# Altium schematic sheet ENC28J60EthernetInterface.SchDoc
size A; SheetNumber: 12; SheetTotal: 14
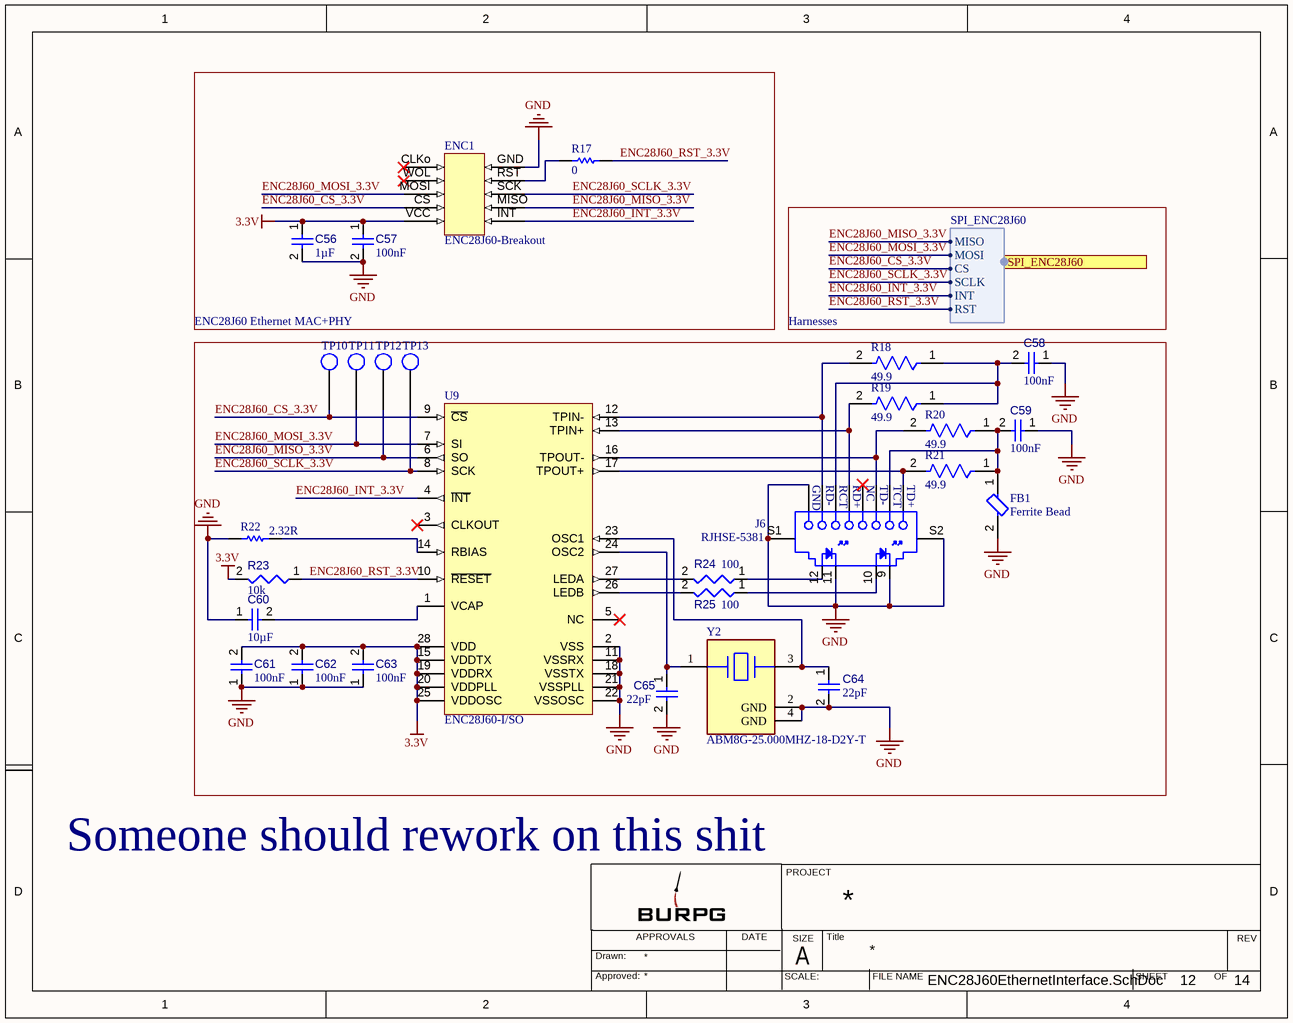
[diagram p0: ENC28J60EthernetInterface.SchDoc]

## Parts
C56  value 1µF  [CAPC2013X135X45NL10T25]  (hidden comment: Capacitor 1 uF +/- 10% 50 V 0805)
C57  value 100nF  [CAPC2013X95X50LL10T25]  (hidden comment: Capacitor 100 nF +/-10% 50 V 0805)
C58  value 100nF  [CAPC1608X90X40NL10T20]  (hidden comment: Capacitor 100 nF +/-10% 50 V 0603)
C59  value 100nF  [CAPC1608X90X40NL10T20]  (hidden comment: Capacitor 100 nF +/-10% 50 V 0603)
C60  value 10µF  [CAPC0603(1608)100_L]  (hidden comment: Capacitor 10µF +/-20% 10V 0603)
C61  value 100nF  [CAPC1608X90X40NL10T20]  (hidden comment: Capacitor 100 nF +/-10% 50 V 0603)
C62  value 100nF  [CAPC1608X90X40NL10T20]  (hidden comment: Capacitor 100 nF +/-10% 50 V 0603)
C63  value 100nF  [CAPC1608X90X40NL10T20]  (hidden comment: Capacitor 100 nF +/-10% 50 V 0603)
C64  value 22pF  [CAPC0402(1005)60_L]  (hidden comment: Capacitor 22pF +/-10% 50V 0402)
C65  value 22pF  [CAPC0402(1005)60_L]  (hidden comment: Capacitor 22pF +/-10% 50V 0402)
ENC1  ENC28J60-Breakout  [New footprint 1]
FB1  Ferrite Bead  [FP-MMZ1608-0_8-IPC_A]
J6  RJHSE-5381  [AMPH-RJHSE-5381_V]
R17  value 0  [RESC3216X60X45ML15T20]  (hidden comment: Resistor 0R +/- 5% 1206 250 mW)
R18  49.9  [FP-ERJ6EN-MFG]
R19  49.9  [FP-ERJ6EN-MFG]
R20  49.9  [FP-ERJ6EN-MFG]
R21  49.9  [FP-ERJ6EN-MFG]
R22  2.32R  [RESC2013X70X40NL20T20]
R23  value 10k  [RESC1005X40X25ML05T05]  (hidden comment: RES-2)
R24  value 100  [RESC0402(1005)_L]  (hidden comment: 100R2F)
R25  value 100  [RESC0402(1005)_L]  (hidden comment: 100R2F)
TP10  BURPG_TestPoint1  [BURPG_TestPoint1]  (value not drawn)  (no BOM)
TP11  BURPG_TestPoint1  [BURPG_TestPoint1]  (value not drawn)  (no BOM)
TP12  BURPG_TestPoint1  [BURPG_TestPoint1]  (value not drawn)  (no BOM)
TP13  BURPG_TestPoint1  [BURPG_TestPoint1]  (value not drawn)  (no BOM)
U9  ENC28J60-I/SO  [SOIC-SO28_M]
Y2  ABM8G-25.000MHZ-18-D2Y-T  [FP-ABM8G-MFG]

## Blocks framed on the sheet
ENC28J60 Ethernet MAC+PHY: C56 C57 ENC1 R17
Harnesses: C58-C65 FB1 J6 R18-R25 TP10-TP13 U9 Y2

## Ports
SPI_ENC28J60 (harness SPI_ENC28J60)

## Harnesses
SPI_ENC28J60: MISO, MOSI, CS, SCLK, INT, RST

## Nets
3.3V: C56.1 C57.1 C61.2 C62.2 C63.2 ENC1.VCC R23.2 U9.15(VDDTX) U9.19(VDDRX) U9.20(VDDPLL) U9.25(VDDOSC) U9.28(VDD)
GND: C56.2 C57.2 C58.1 C59.1 C60.1 C61.1 C62.1 C63.1 C64.2 C65.2 ENC1.GND FB1.2 J6.8(GND) J6.9 J6.11 J6.S1 J6.S2 R22.1 U9.2(VSS) U9.11(VSSRX) U9.18(VSSTX) U9.21(VSSPLL) U9.22(VSSOSC) Y2.2(GND) Y2.4(GND)
ENC28J60_CS_3.3V: ENC1.CS TP10.1 U9.9(~{CS}) ; port SPI_ENC28J60.CS
ENC28J60_INT_3.3V: ENC1.INT U9.4(~{INT}) ; port SPI_ENC28J60.INT
ENC28J60_MISO_3.3V: ENC1.MISO TP12.1 U9.6(SO) ; port SPI_ENC28J60.MISO
ENC28J60_MOSI_3.3V: ENC1.MOSI TP11.1 U9.7(SI) ; port SPI_ENC28J60.MOSI
ENC28J60_RST_3.3V: R17.2 R23.1 U9.10(~{RESET}) ; port SPI_ENC28J60.RST
ENC28J60_SCLK_3.3V: ENC1.SCK TP13.1 U9.8(SCK) ; port SPI_ENC28J60.SCLK
NetC58_2: C58.2 J6.6(RCT) R18.1 R19.1
NetC59_2: C59.2 FB1.1 J6.2(TCT) R20.1 R21.1
NetC60_2: C60.2 U9.1(VCAP)
NetC64_1: C64.1 U9.23(OSC1) Y2.3
NetC65_1: C65.1 U9.24(OSC2) Y2.1
NetENC1_RST: ENC1.RST R17.1
NetJ6_1: J6.1(TD+) R21.2 U9.17(TPOUT+)
NetJ6_3: J6.3(TD-) R20.2 U9.16(TPOUT-)
NetJ6_5: J6.5(RD+) R19.2 U9.13(TPIN+)
NetJ6_7: J6.7(RD-) R18.2 U9.12(TPIN-)
NetJ6_10: J6.10 R25.1
NetJ6_12: J6.12 R24.1
NetR22_2: R22.2 U9.14(RBIAS)
NetR24_2: R24.2 U9.27(LEDA)
NetR25_2: R25.2 U9.26(LEDB)

Not connected (* = marked no-connect by the designer): ENC1 CLKo* WOL*; J6 4(NC)*; U9 3(CLKOUT)* 5(NC)*

## Notes on the sheet
- Someone should rework on this shit
- PROJECT
- Drawn:
- Approved:
- APPROVALS
- DATE
- SCALE:
- SIZE
- A
- Title
- FILE NAME
- SHEET
- OF
- REV

## Library data of the parts
C56 = CMP-001-00007-6: Chip Capacitor, 1 uF, +/- 10%, 50 V, 0805 (2012 Metric); Capacitor Type: Ceramic; Voltage Rating: 50V; Case/Package: 0805; Max Operating Temperature: 125°C; Min Operating Temperature: -55°C; Mounting Technology: SM; Pins: 2; RoHS Compliant: True; Tolerance: 10%
C57 = CMP-001-00018-6: Chip Capacitor, 100 nF, +/- 10%, 50 V, 0805 (2012 Metric); Capacitor Type: Ceramic; Voltage Rating: 50V; Case/Package: 0805; Max Operating Temperature: 125°C; Min Operating Temperature: -55°C; Mounting Technology: SM; Pins: 2; RoHS Compliant: True; Tolerance: 10%
C58 C59 C61-C63 = CMP-001-00017-6: Chip Capacitor, 100 nF, +/- 10%, 50 V, 0603 (1608 Metric); Voltage Rating: 50V; Capacitor Type: Ceramic; Tolerance: 10%; Mounting Technology: SM; Max Operating Temperature: 125°C; RoHS Compliant: True; Pins: 2; Case/Package: 0603; Min Operating Temperature: -55°C
C60 = CMP-001-00075-4: Chip Capacitor, 10µF +/-20%, 10V, 0603, Thickness 1 mm; Tolerance: 10%; Voltage Rating: 10V; Max Operating Temperature: 85°C; Pins: 2; Case/Package: 0603; Mounting Technology: SMT; Min Operating Temperature: -55°C
C64 C65 = CMP-001-00073-3: Chip Capacitor, 22pF +/-10%, 50V, 0402, Thickness 0.6 mm; Tolerance: 10%; Pins: 2; Voltage Rating: 50V; Max Operating Temperature: 85°C; Min Operating Temperature: -55°C; Mounting Technology: SMT; Case/Package: 0402
ENC1 = CMP-031-00007-1
FB1 = CMP-08257-000284-1: Signal Line Ferrite Bead 60Ω  @ 100MHz 500mA DCR 150mΩ SMD 0603; DC Resistance (DCR): 150mR; Impedance: 60R; Tolerance: 25%; Case/Package: 0603; RoHS Compliant: Yes; Package Quantity: 4000; Lead Free: Lead Free; Case Code (Imperial): 0603; Height: 0.037inch; REACH SVHC: No SVHC; Case Code (Metric): 1608; Packaging: Cut Tape; Mount: Surface Mount; Max DC Current: 500mA; Width: 0.031inch; Length: 0.063inch; Core Material: Ferrite; Current Rating: 500mA
J6 = CMP-2000-06980-1: High Speed RJ45, Modular Jack, 8 Position, 8 Contacts, Shielded, with LEDs, -55 to 85 degC,12-Pin THD, RoHS, Tray; Manufacturer: Amphenol; Number of Positions/Contacts: 8p8c(RJ45,Ethernet); Number of Ports: 1; Catalog Drawings: RJ45SeriesRightAngle; PCN Design/Specification: MultipleSeriesCopper29/Jan/2009RJHSEShieldMaterial30/Jun/2015; Other Names: RJHSE5381; Online Catalog: RJHSESeries; Featured Product: ModularJacksProductSolutions; Tab Direction: Up; Shielding: Shielded,EMIFinger; LED Color: Yellow-Green; 3D Model: RJHSE538x.stpRJHSE538x.igs; Category: Connectors,Interconnects; Termination: Solder; Housing Material: Thermoplastic; Mounting Type: ThroughHole; Family: ModularConnectors-Jacks; Orientation: 90°Angle(Right); Features: BoardLock; Contact Material: PhosphorBronze; Mounting Technology: ThroughHole; Number of Rows: 1; Standard Package: 120; Ratings: -; Operating Temperature: -55°C~85°C; Series: RJHSE; Contact Finish: Gold; Package Reference: RJHSE-5381; Ingress Protection: -; Package Description: 12-Pin Through Hole Device, Body 16.51 x 15.75 mm; Contact Finish Thickness: 50µin(1.27µm); Datasheet URL: https://datasheet.ciiva.com/16481/rjhse538x-16481714.pdf; Datasheet Version: Rev. K, 04/2014; Connector Type: Jack; Manufacturer URL: http://www.amphenol.com/; Packaging: Tray
R17 = CMP-009-00002-5: Chip Resistor, 0 Ohm, +/- 5%, 0.25 W, -55 to 155 degC, 1206 (3216 Metric); Voltage Rating: 200V; Power: 250mW; Tolerance: 5%; Min Operating Temperature: -55°C; Mounting Technology: SM; Max Operating Temperature: 155°C; Case/Package: 1206; RoHS Compliant: True; Pins: 2
R18-R21 = CMP-2001-00215-5: RES SMD 49.9 OHM 1% 1/8W 0805; Voltage Rating (DC): 150V; Resistance: 49.9R; Temperature Coefficient: 100ppm/°C; Power Rating: 125mW; Mount: Surface Mount; Max Operating Temperature: 155°C; Resistor Type: Thick Film; Case Code (Metric): 2012; RoHS Compliant: Yes; Weight: 0.000194oz; Technology: THICK FILM; Number of Terminations: 2; Case Code (Imperial): 0805; Case/Package: 0805; Contact Plating: Tin; Package Quantity: 1; Voltage Rating: 150V; Radiation Hardening: No; Length: 2mm; Resistance Tolerance: 1%; Construction: Rectangular; Height: 0.6mm; Lead Free: Lead Free; Features: Automotive AEC-Q200; Width: 1.2mm; Depth: 1.25mm; Max Power Dissipation: 125mW; Series: ERJ; Termination: SMD/SMT; Reach SVHC Compliant: Yes; Tolerance: 1%; Size Code: 0805; Packaging: Tape and Reel; Min Operating Temperature: -55°C; Military Standard: Not
R22 = CMP-2001-00058-1: Manufacturer: Panasonic; Part Number: ERJ-6ENF2321V
R23 = CMP-009-00015-5: Chip Resistor, 10 KOhm, +/- 1%, 0.1 W, -55 to 155 degC, 0402 (1005 Metric); Power: 100mW; Voltage Rating: 50V; Case/Package: 0402; Max Operating Temperature: 155°C; Min Operating Temperature: -55°C; Mounting Technology: SM; Pins: 2; RoHS Compliant: True; Tolerance: 1%
R24 R25 = CMP-009-00065-2: 100R 0.063W 1% 0402 (1005 Metric)  SMD; Power: 63mW; Case/Package: 0402; Mounting Technology: SMT; Pins: 2; Tolerance: 1%
U9 = CMP-0186-00132-2: Stand-Alone Ethernet Controller with SPI Interface, 28-Pin SOIC, Industrial Temperature; Code_JEDEC: MS-013; ComponentLink2URL: http://ww1.microchip.com/downloads/en/DeviceDoc/39662c.pdf; PackageDescription: 28-Lead Plastic Small Outline (SO) - Wide 7.50mm Body [SOIC]; RevisionNote: URLs added.; ComponentLink2Description: Datasheet; ComponentLink1Description: Manufacturer URL; ComponentLink3Description: Package Specification; DatasheetVersion: revC, Jan-2008; ComponentLink1URL: http://www.microchip.com/; ComponentLink3URL: http://www.microchip.com/stellent/groups/techpub_sg/documents/packagingspec/en012702.pdf; PackageVersion: revBB, Aug-2009; PackageReference: SOIC-SO28
Y2 = CMP-2000-05733-3: Crystal 25MHz ±20ppm (Tol) ±30ppm (Stability) 18pF FUND 60Ω 4-Pin SMD T/R; Series Resistance: 60R; Length: 3.2mm; Depth: 2.5mm; Packaging: Tape and Reel; Min Operating Temperature: -40°C; Operating Frequency: 25 MHz; Lead Free: Lead Free; Number of Pins: 4; Frequency Tolerance: 20ppm; Radiation Hardening: No; Max Operating Temperature: 85°C; Termination: SMD/SMT; Frequency Stability: 30ppm; Frequency: 25MHz; Series: ABM8G; Mount: Surface Mount; Package Quantity: 1000; Height: 0.039inch; Width: 0.098inch; Case/Package: CSMD; ESR (Equivalent Series Resistance): 60R; Load Capacitance: 18pF; Tolerance: 20ppm